# EAGLE design fan-host-board-v1.1-(WIP) (EAGLE 9.6.2)
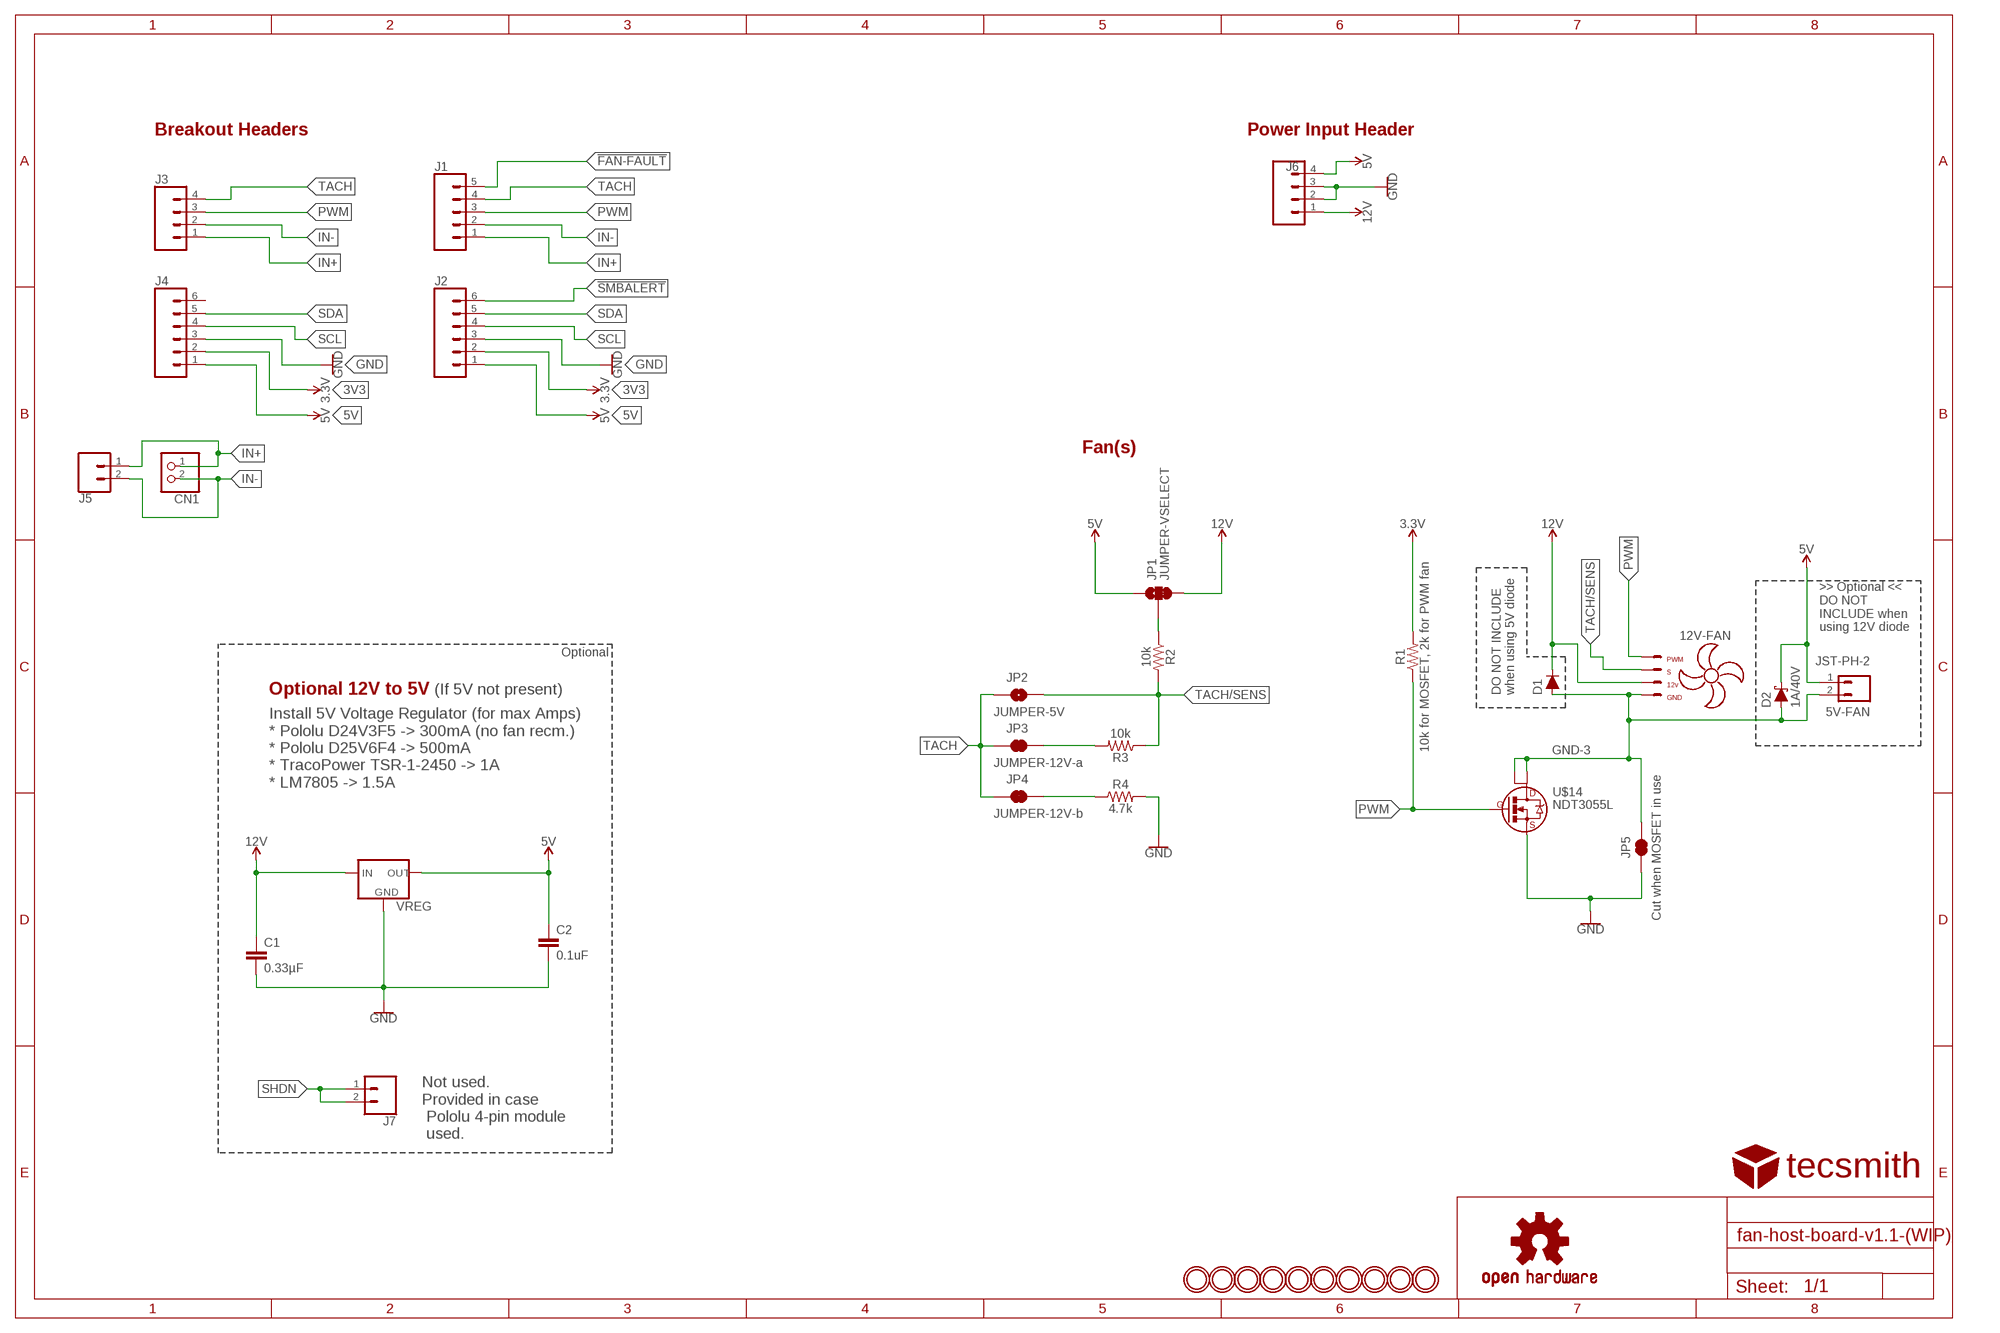
[diagram p0: schematic, sheet 1]

## Parts
5V-FAN  JST-PH-2  [JST-PH2]
12V-FAN  KK-254-4KK-254  [MOLEX_47053-1000]
C1  0.33µF  0.33UF/330NF-0805-50V-10%  [0805]
C2  0.1uF  0.1UF-0603-25V-5%  [0603]
CN1  JST_2PIN-THM  [JST-PH-2-THM]
D1  200mA/100V  DIODE-1N4148  [DIODE-1N4148]
D2  1A/40V  DIODE-SCHOTTKY-SS14  [SMA-DIODE]
J1  CONN_05  [1X05]
J2  CONN_06SILK_FEMALE_PTH  [1X06]
J3  CONN_04PTH  [1X04]
J4  CONN_06SILK_FEMALE_PTH  [1X06]
J5  CONN_02PTH3  [1X02_LONGPADS]
J6  CONN_04SCREW  [SCREWTERMINAL-3.5MM-4]
J7  CONN_021X02_NO_SILK  [1X02_NO_SILK]
JP1  JUMPER-VSELECT  JUMPER-SMT_3_1-NC_TRACE_SILK  [SMT-JUMPER_3_1-NC_TRACE_SILK]
JP2  JUMPER-5V  JUMPER-SMT_2_NO_NO_SILK  [SMT-JUMPER_2_NO_SILK]
JP3  JUMPER-12V-a  JUMPER-SMT_2_NC_TRACE_SILK  [SMT-JUMPER_2_NC_TRACE_SILK]
JP4  JUMPER-12V-b  JUMPER-SMT_2_NC_TRACE_SILK  [SMT-JUMPER_2_NC_TRACE_SILK]
JP5  Cut when MOSFET in use  JUMPER-SMT_2_NC_TRACE_NO-SILK  [SMT-JUMPER_2_NC_TRACE_NO-SILK]
LOGO1  OSHW-LOGOS  [OSHW-LOGO-S]
R1  10k for MOSFET, 2k for PWM fan  2.2KOHM-0603-1/10W-1%  [0603]
R2  10k  10KOHM-0603-1/10W-1%  [0603]
R3  10k  10KOHM-0603-1/10W-1%  [0603]
R4  4.7k  4.7KOHM-0603-1/10W-1%  [0603]
U$1  TECSMITH-LOGO  [TECSMITH-LOGO]
U$2  MOUNTINGHOLE2.5  [MOUNTINGHOLE_2.5_PLATED]
U$3  MOUNTINGHOLE2.5  [MOUNTINGHOLE_2.5_PLATED]
U$4  MOUNTINGHOLE2.5  [MOUNTINGHOLE_2.5_PLATED]
U$5  MOUNTINGHOLE2.5  [MOUNTINGHOLE_2.5_PLATED]
U$6  MOUNTINGHOLE2.5  [MOUNTINGHOLE_2.5_PLATED]
U$7  MOUNTINGHOLE2.5  [MOUNTINGHOLE_2.5_PLATED]
U$8  MOUNTINGHOLE2.5  [MOUNTINGHOLE_2.5_PLATED]
U$9  MOUNTINGHOLE2.5  [MOUNTINGHOLE_2.5_PLATED]
U$10  MOUNTINGHOLE2.5  [MOUNTINGHOLE_2.5_PLATED]
U$11  MOUNTINGHOLE2.5  [MOUNTINGHOLE_2.5_PLATED]
U$14  NDT3055L  [SOT223]
VREG  TRACOPOWER-TSR-1  [TRACO-TSR-1]

## Nets
3V3: J2.2 J4.2 R1.2 ; supply symbol labelled 3.3V
5V: 5V-FAN.1 C2.1 D2.C J2.1 J4.1 J6.4 JP1.1 VREG.P$+VOUT(OUT)
12V: 12V-FAN.2:+12VDC C1.1 D1.C J6.1 JP1.3 VREG.P$+VIN(IN)
!FAN-FAULT: J1.5
!SMBALERT: J2.6
GND: C1.2 C2.2 J2.3 J4.3 J6.2 J6.3 JP5.1 R4.2 U$14.S VREG.P$GND(GND)
GND-3: 5V-FAN.2 12V-FAN.1:GND D1.A D2.A JP5.2 U$14.D U$14.D2
IN+: CN1.1 J1.1 J3.1 J5.1
IN-: CN1.2 J1.2 J3.2 J5.2
N$4: JP1.2 R2.1
N$5: JP3.2 R3.2
N$6: JP4.2 R4.1
PWM: 12V-FAN.4:PWM J1.3 J3.3 R1.1 U$14.G
SCL: J2.4 J4.4
SDA: J2.5 J4.5
SHDN: J7.1 J7.2
TACH: J1.4 J3.4 JP2.1 JP3.1 JP4.1
TACH/SENS: 12V-FAN.3:TACH JP2.2 R2.2 R3.1
Unconnected: J4.6

## Notes on the sheet
- Breakout Headers | Power Input Header
- Fan(s)
- >> Optional <<
  DO NOT
  INCLUDE when
  using 12V diode
- Optional
- Optional 12V to 5V | (If 5V not present)
- DO NOT INCLUDE
  when using 5V diode
- Install 5V Voltage Regulator (for max Amps)
  * Pololu D24V3F5 -> 300mA (no fan recm.)
  * Pololu D25V6F4 -> 500mA
  * TracoPower TSR-1-2450 -> 1A
  * LM7805 -> 1.5A
- Not used.
  Provided in case
   Pololu 4-pin module
   used.

## Library data of the parts
5V-FAN = VinoRodrigues_Custom_Eagle:JST-PH-2
12V-FAN = VinoRodrigues_Custom_Eagle:KK-254-4
C1 = SparkFun-Capacitors:0.33UF/330NF: 0.33µF/330nF ceramic capacitors A capacitor is a passive two-terminal electrical component used to store electrical energy temporarily in an electric field.; PROD_ID: CAP-08469
C2 = SparkFun-Capacitors:0.1UF: 0.1µF ceramic capacitors A capacitor is a passive two-terminal electrical component used to store electrical energy temporarily in an electric field.; PROD_ID: CAP-08604
CN1 = adafruit:JST_2PIN: JST 2-Pin Connectors of various flavors SMT-RA (S2B-PH-SM4) 4UConnector #17311 SMT (B2B-PH-SM4) THM-RA (S2B-PH) THM (B2B-PH)
D1 = SparkFun-DiscreteSemi:DIODE: Diode These are standard reverse protection diodes and small signal diodes. SparkFun Products: SparkFun SparkPunk Sound Kit <https://www.sparkfun.com/products/11177> SparkFun ESP8266 Thing <https://www.sparkfun.com/products/13231>; PROD_ID: DIO-08378; VALUE: 200mA/100V/1V
D2 = SparkFun-DiscreteSemi:DIODE-SCHOTTKY: Schottky diode A Schottky diode is a semiconductor diode which has a low forward voltage drop and a very fast switching action.; PROD_ID: DIO-08053; VALUE: 1A/40V/500mV
J1 = SparkFun-Connectors:CONN_05: Multi connection point. Often used as Generic Header-pin footprint for 0.1 inch spaced/style header connections On any of the 0.1 inch spaced packages, you can populate with these: Break Away Headers - Straight <https://www.sparkfun.com/products/116> (PRT-00116) Break Away Male Headers - Right Angle <https://www.sparkfun.com/products/553> (PRT-00553) Female Headers <https://www.sparkfun.com/products/115> (PRT-00115) Break Away Headers - Machine Pin <https://www.sparkfun.com/products/117> (PRT-00117) Break Away Female Headers - Swiss Machine Pin <https://www.sparkfun.com/products/743> (PRT-00743) For SCREWTERMINALS and SPRING TERMINALS visit here: Screw Terimnals on SparkFun.com <https://www.sparkfun.com/search/results?term=Screw+Terminals> (5mm/3.5mm/2.54mm spacing) This device is also useful as a general connection point to wire up your design to another part of your project. Our various solder wires solder well into these plated through hole pads. Hook-Up Wire - Assortment (Stranded, 22 AWG) <https://www.sparkfun.com/products/11375> (PRT-11375) Hook-Up Wire - Assortment (Solid Core, 22 AWG) <https://www.sparkfun.com/products/11367> (PRT-11367) View the entire wire category on our website here <https://www.sparkfun.com/categories/141> Special notes: Molex polarized connector foot print use with SKU : PRT-08231 with associated crimp pins and housings. 1MM SMD Version SKU: PRT-10208
J2 J4 = SparkFun-Connectors:CONN_06: Multi connection point. Often used as Generic Header-pin footprint for 0.1 inch spaced/style header connections On any of the 0.1 inch spaced packages, you can populate with these: Break Away Headers - Straight <https://www.sparkfun.com/products/116> (PRT-00116) Break Away Male Headers - Right Angle <https://www.sparkfun.com/products/553> (PRT-00553) Female Headers <https://www.sparkfun.com/products/115> (PRT-00115) Break Away Headers - Machine Pin <https://www.sparkfun.com/products/117> (PRT-00117) Break Away Female Headers - Swiss Machine Pin <https://www.sparkfun.com/products/743> (PRT-00743) Arduino Stackable Header - 6 Pin <https://www.sparkfun.com/products/9280> (PRT-09280) For SCREWTERMINALS and SPRING TERMINALS visit here: Screw Terimnals on SparkFun.com <https://www.sparkfun.com/search/results?term=Screw+Terminals> (5mm/3.5mm/2.54mm spacing) This device is also useful as a general connection point to wire up your design to another part of your project. Our various solder wires solder well into these plated through hole pads. Hook-Up Wire - Assortment (Stranded, 22 AWG) <https://www.sparkfun.com/products/11375> (PRT-11375) Hook-Up Wire - Assortment (Solid Core, 22 AWG) <https://www.sparkfun.com/products/11367> (PRT-11367) View the entire wire category on our website here <https://www.sparkfun.com/categories/141>; PROD_ID: CONN-08437
J3 = SparkFun-Connectors:CONN_04: Multi connection point. Often used as Generic Header-pin footprint for 0.1 inch spaced/style header connections On any of the 0.1 inch spaced packages, you can populate with these: Break Away Headers - Straight <https://www.sparkfun.com/products/116> (PRT-00116) Break Away Male Headers - Right Angle <https://www.sparkfun.com/products/553> (PRT-00553) Female Headers <https://www.sparkfun.com/products/115> (PRT-00115) Break Away Headers - Machine Pin <https://www.sparkfun.com/products/117> (PRT-00117) Break Away Female Headers - Swiss Machine Pin <https://www.sparkfun.com/products/743> (PRT-00743) For SCREWTERMINALS and SPRING TERMINALS visit here: Screw Terimnals on SparkFun.com <https://www.sparkfun.com/search/results?term=Screw+Terminals> (5mm/3.5mm/2.54mm spacing) This device is also useful as a general connection point to wire up your design to another part of your project. Our various solder wires solder well into these plated through hole pads. Hook-Up Wire - Assortment (Stranded, 22 AWG) <https://www.sparkfun.com/products/11375> (PRT-11375) Hook-Up Wire - Assortment (Solid Core, 22 AWG) <https://www.sparkfun.com/products/11367> (PRT-11367) View the entire wire category on our website here <https://www.sparkfun.com/categories/141> Special notes: Molex polarized connector foot print use with SKU : PRT-08231 with associated crimp pins and housings. 1MM SMD Version SKU: PRT-10208; PROD_ID: CONN-09696
J5 J7 = SparkFun-Connectors:CONN_02: Multi connection point. Often used as Generic Header-pin footprint for 0.1 inch spaced/style header connections On any of the 0.1 inch spaced packages, you can populate with these: Break Away Headers - Straight <https://www.sparkfun.com/products/116> (PRT-00116) Break Away Male Headers - Right Angle <https://www.sparkfun.com/products/553> (PRT-00553) Female Headers <https://www.sparkfun.com/products/115> (PRT-00115) Break Away Headers - Machine Pin <https://www.sparkfun.com/products/117> (PRT-00117) Break Away Female Headers - Swiss Machine Pin <https://www.sparkfun.com/products/743> (PRT-00743) For SCREWTERMINALS and SPRING TERMINALS visit here: Screw Terimnals on SparkFun.com <https://www.sparkfun.com/search/results?term=Screw+Terminals> (5mm/3.5mm/2.54mm spacing) This device is also useful as a general connection point to wire up your design to another part of your project. Our various solder wires solder well into these plated through hole pads. Hook-Up Wire - Assortment (Stranded, 22 AWG) <https://www.sparkfun.com/products/11375> (PRT-11375) Hook-Up Wire - Assortment (Solid Core, 22 AWG) <https://www.sparkfun.com/products/11367> (PRT-11367) View the entire wire category on our website here <https://www.sparkfun.com/categories/141> Special notes: Molex polarized connector foot print use with: PRT-08233 with associated crimp pins and housings. 2.54_SCREWTERM for use with PRT-10571. 3.5mm Screw Terminal footprints for PRT-08084 5mm Screw Terminal footprints for use with PRT-08432
J6 = SparkFun-Connectors:CONN_04: Multi connection point. Often used as Generic Header-pin footprint for 0.1 inch spaced/style header connections On any of the 0.1 inch spaced packages, you can populate with these: Break Away Headers - Straight <https://www.sparkfun.com/products/116> (PRT-00116) Break Away Male Headers - Right Angle <https://www.sparkfun.com/products/553> (PRT-00553) Female Headers <https://www.sparkfun.com/products/115> (PRT-00115) Break Away Headers - Machine Pin <https://www.sparkfun.com/products/117> (PRT-00117) Break Away Female Headers - Swiss Machine Pin <https://www.sparkfun.com/products/743> (PRT-00743) For SCREWTERMINALS and SPRING TERMINALS visit here: Screw Terimnals on SparkFun.com <https://www.sparkfun.com/search/results?term=Screw+Terminals> (5mm/3.5mm/2.54mm spacing) This device is also useful as a general connection point to wire up your design to another part of your project. Our various solder wires solder well into these plated through hole pads. Hook-Up Wire - Assortment (Stranded, 22 AWG) <https://www.sparkfun.com/products/11375> (PRT-11375) Hook-Up Wire - Assortment (Solid Core, 22 AWG) <https://www.sparkfun.com/products/11367> (PRT-11367) View the entire wire category on our website here <https://www.sparkfun.com/categories/141> Special notes: Molex polarized connector foot print use with SKU : PRT-08231 with associated crimp pins and housings. 1MM SMD Version SKU: PRT-10208; PROD_ID: CONN-14485
JP1 = SparkFun-Jumpers:JUMPER-SMT_3_1-NC_TRACE: Normally closed trace jumper (1 of 2 connections) This jumper has a trace between two pads so it's normally closed (NC). The other connection is normally open (NO). Use a razor knife to open the connection. For best results follow the IPC guidelines for cutting traces: Cutout at least 0.063 mm (0.005 in). Remove all loose material to clean up the cut area. Seal the cut with an approved epoxy. Reapply solder to reclose the connection, or to close the NO connection.
JP2 = VinoRodrigues_Custom_Eagle:JUMPER-SMT_2_NO
JP3-JP5 = SparkFun-Jumpers:JUMPER-SMT_2_NC_TRACE: Normally closed trace jumper This jumper has a trace between two pads so it's normally closed (NC). Use a razor knife to open the connection. For best results follow the IPC guidelines for cutting traces: Cutout at least 0.063 mm (0.005 in). Remove all loose material to clean up the cut area. Seal the cut with an approved epoxy. Reapply solder to reclose the connection.
LOGO1 = SparkFun-Aesthetics:OSHW-LOGO: Open-Source Hardware (OSHW) Logo This logo indicates the piece of hardware it is found on incorporates a OSHW license and/or adheres to the definition of open source hardware found here: http://freedomdefined.org/OSHW
R1 = SparkFun-Resistors:2.2KOHM: 2.2kΩ resistor A resistor is a passive two-terminal electrical component that implements electrical resistance as a circuit element. Resistors act to reduce current flow, and, at the same time, act to lower voltage levels within circuits. - Wikipedia; PROD_ID: RES-08272; VALUE: 2.2k
R2 R3 = SparkFun-Resistors:10KOHM: 10kΩ resistor A resistor is a passive two-terminal electrical component that implements electrical resistance as a circuit element. Resistors act to reduce current flow, and, at the same time, act to lower voltage levels within circuits. - Wikipedia; PROD_ID: RES-00824
R4 = SparkFun-Resistors:4.7KOHM: 4.7kΩ resistor A resistor is a passive two-terminal electrical component that implements electrical resistance as a circuit element. Resistors act to reduce current flow, and, at the same time, act to lower voltage levels within circuits. - Wikipedia; PROD_ID: RES-07857
U$1 = VinoRodrigues_Custom_Eagle:TECSMITH-LOGO
U$2-U$11 = microbuilder:MOUNTINGHOLE: Mounting Hole For #2 screws (0.086"/2.18mm width, 0.094"/2.4mm hole) use 2.5mm; BOM: EXCLUDE
U$14 = VinoRodrigues_Custom_Eagle:NDT3055L
VREG = VinoRodrigues_Custom_Eagle:TRACOPOWER-TSR-1

## Board
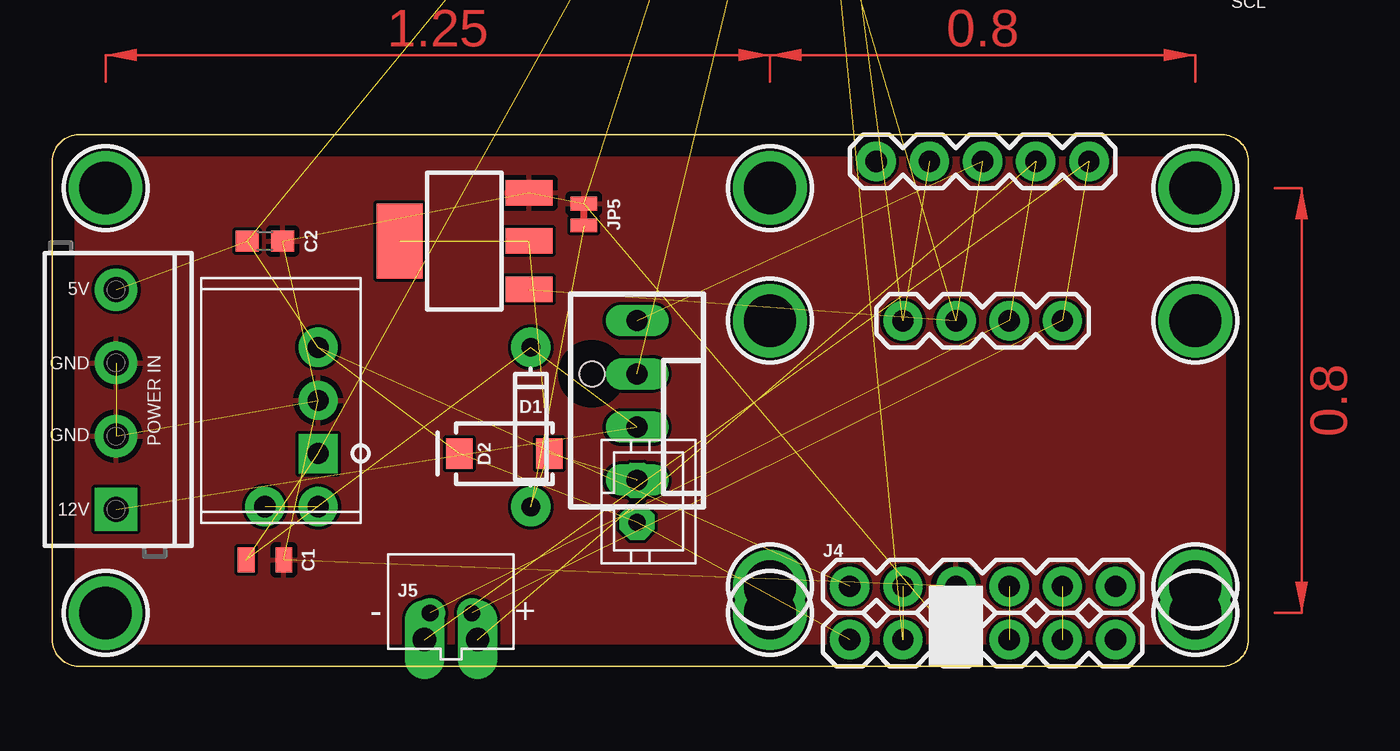
[diagram p1: board, top side]
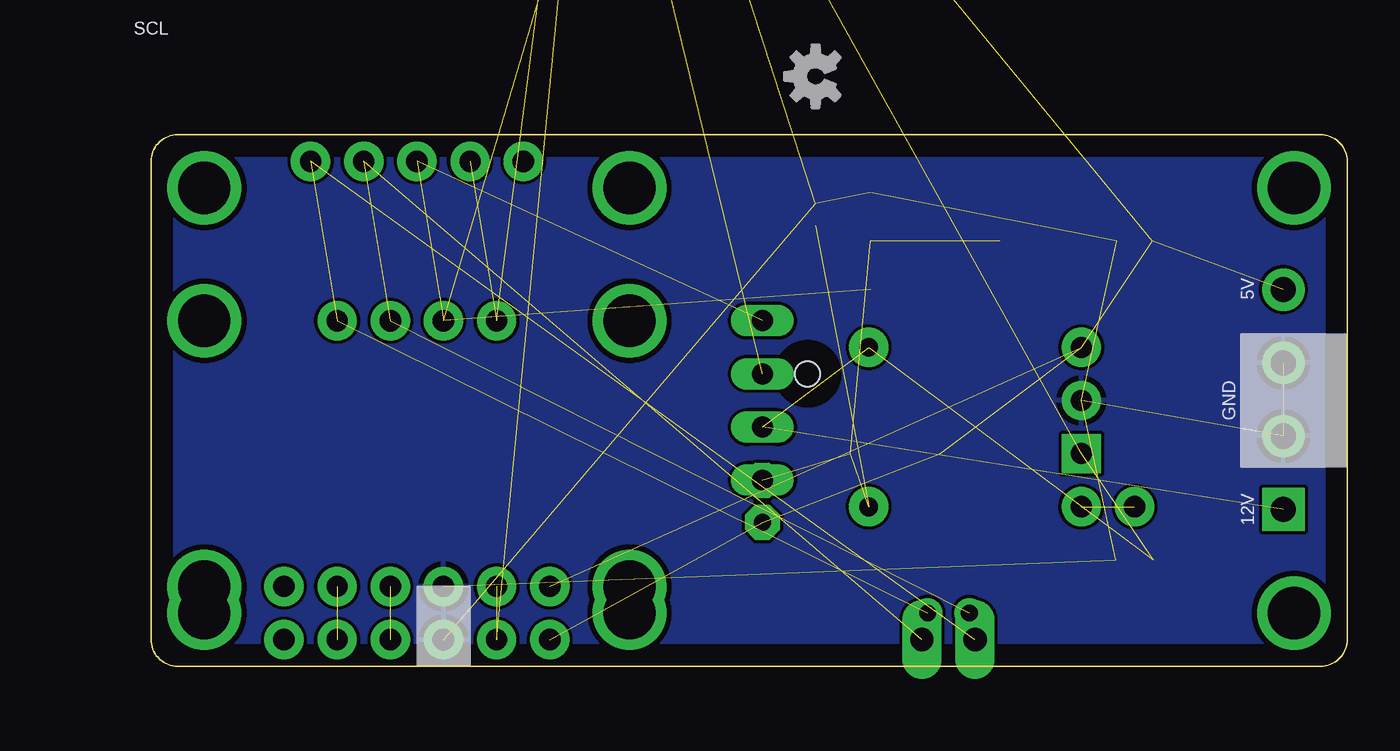
[diagram p2: board, bottom side, seen from below]

Size 57.15 x 25.4 mm. Coordinates in mm from the lower left corner, seen from the top.
Outline: 1.27,0 55.88,0 arc90 57.15,1.27 57.15,24.13 arc90 55.88,25.4 1.27,25.4 arc90 0,24.13 0,1.27 arc90 1.27,0
Copper layers (1*16): Top 0.035mm / dielectric 1.5mm / Bottom 0.035mm
Design rules "default": minimum track width 6mil, minimum drill 0.35mm, track to track 6mil, track to pad 6mil, pad to pad 6mil, via to via 6mil, smd to smd 6mil, copper to edge 40mil, drill to drill 6mil, minimum pad ring 10mil, minimum via ring 8mil, stop-mask expansion 4mil, vias tented up to drill 0mil, thermal gap 10mil

### Footprints (pad centres in the part's own frame; a part is rotated, then mirrored left to right if it is on the bottom)
JST-PH2 = drill 0.813 pad 1.676 octagon: 1 1,0; 2 -1,0
MOLEX_47053-1000 = drill 1 long: 1:GND 3.81,0; 2:+12VDC 1.27,0; 3:TACH -1.27,0; 4:PWM -3.81,0 | hole 1.2: -1.27,-2.159
0805 = smd 0.8 x 1.2: 1 -0.9,0; 2 0.9,0
0603 = smd 1.1 x 1: 1 -0.85,0; 2 0.85,0
JST-PH-2-THM = drill 0.8 pad 1.422: 1 1,0; 2 -1,0
DIODE-1N4148 = drill 0.9 pad 1.88: A -3.81,0; C 3.81,0
SMA-DIODE = smd 1.27 x 1.47: A -2.15,0; C 2.15,0
1X05 = drill 1.016 pad 1.88: 1 0,0; 2 2.54,0; 3 5.08,0; 4 7.62,0; 5 10.16,0
1X06 = drill 1.016 pad 1.88: 1 0,0; 2 2.54,0; 3 5.08,0; 4 7.62,0; 5 10.16,0; 6 12.7,0
1X04 = drill 1.016 pad 1.88: 1 0,0; 2 2.54,0; 3 5.08,0; 4 7.62,0
1X02_LONGPADS = drill 1.118 pad 1.88 long: 1 0,0; 2 2.54,0
SCREWTERMINAL-3.5MM-4 = drill 1.2 pad 2.032 square: 1 0,0 | drill 1.2 pad 2.032: 2 3.5,0; 3 7,0; 4 10.5,0
1X02_NO_SILK = drill 1.016 pad 1.88: 1 0,0; 2 2.54,0
SMT-JUMPER_3_1-NC_TRACE_SILK = smd 0.66 x 1.27: 1 -1.041,0; 2 0,0; 3 1.041,0
SMT-JUMPER_2_NO_SILK = smd 0.66 x 1.27: 1 -0.521,0; 2 0.521,0
SMT-JUMPER_2_NC_TRACE_SILK = smd 0.66 x 1.27: 1 -0.521,0; 2 0.521,0
SMT-JUMPER_2_NC_TRACE_NO-SILK = smd 0.66 x 1.27: 1 -0.521,0; 2 0.521,0
MOUNTINGHOLE_2.5_PLATED = drill 2.5 pad 3.2: P$1 0,0
SOT223 = smd 1.219 x 2.235: D 0,-3.099; G -2.311,-3.099; S 2.311,-3.099 | smd 3.6 x 2.2: D2 0,3.099
TRACO-TSR-1 = drill 1 pad 1.88 square: P$+VIN -2.54,0 | drill 1 pad 1.88: P$+VOUT 2.54,0; P$GND 0,0

### Placement (x,y rotation side)
5V-FAN  27.94,7.87 270 top
12V-FAN  27.94,12.7 270 top
C1  10.16,5.08 0 top
C2  10.16,20.32 0 top
CN1  19.05,2.54 0 top
D1  22.86,11.43 90 top
D2  21.59,10.16 180 top
J1  49.53,24.13 180 top
J2  38.1,1.27 0 top
J3  48.26,16.51 180 top
J4  38.1,3.81 0 top
J5  17.78,1.27 0 top
J6  3.05,7.49 90 top
J7  12.7,7.62 180 top
JP1  33.66,48.9 270 bottom  (outside the outline)
JP2  37.47,51.44 180 bottom  (outside the outline)
JP3  37.47,48.26 180 bottom  (outside the outline)
JP4  37.47,45.09 180 bottom  (outside the outline)
JP5  25.4,21.59 270 top
LOGO1  25.4,28.19 90 bottom
R1  35.56,45.09 0 top  (outside the outline)
R2  34.29,50.8 0 top  (outside the outline)
R3  35.56,48.9 180 top  (outside the outline)
R4  34.29,46.99 180 top  (outside the outline)
U$1  19.68,44.07 0 bottom  (outside the outline)
U$2  34.29,3.81 0 top
U$3  34.29,16.51 0 top
U$4  2.54,2.54 0 top
U$5  2.54,22.86 0 top
U$6  34.29,2.54 0 top
U$7  34.29,22.86 0 top
U$8  54.61,2.54 0 top
U$9  54.61,22.86 0 top
U$10  54.61,16.51 0 top
U$11  54.61,3.81 0 top
U$14  19.68,20.32 90 top
VREG  12.7,12.7 90 top

### Tracks (layer width: path | path; a pad name or v marks a point on that pad's centre or on a via)
3V3  (2 unrouted)
5V  (7 unrouted)
12V  (5 unrouted)
GND  (9 unrouted)
  pour Top: 0,0 0,25.4 57.15,25.4 57.15,0
  pour Bottom: 0,0 0,25.4 57.15,25.4 57.15,0
GND-3  (6 unrouted)
IN+  (3 unrouted)
IN-  (3 unrouted)
N$4  (1 unrouted)
N$5  (1 unrouted)
N$6  (1 unrouted)
PWM  (4 unrouted)
SCL  (1 unrouted)
SDA  (1 unrouted)
SHDN  (1 unrouted)
TACH  (4 unrouted)
TACH/SENS  (3 unrouted)
(copper drawn outside any net)
  shapes: Top area x3

### Text on the board
tNames: FAN | 3V3 | 5V | VOUT / 5V | VIN / 12V | N/C | DP / IN+ | ALERT | GND | DN / IN- | VOLTAGE / REGULATOR | GND | SDA | PWM | TACH | MOSFET | FAN | SCL | 5V | GND | POWER IN | GND | 12V
bNames: 5V | GND | Rev. 1.0 | 5V | 5V | 3V3 | GND | 5V/VOUT | 12V/VIN | N/C | 12V | 5V | 12V | DP/IN+ | ALERT | 12V | DN/IN- | TACH CONTROL | SDA | FAN Host Board / http://c1k.it/amc6 / for AMC6821 & / EMC2101 breakout boards | GND | PWM | to GND | to / MFET | TACH | to / FAN | (c) 2021 Tecsmith / Vino Rodrigues | PWM | TACH | 12V | GND-F | to / MFET | PWM / CONTROL | SCL | 5V | GND | 12V